# Altium schematic sheet Audio_Moduloop.SchDoc: Audio_Moduloop
size A; Date: 2/27/2024; DrawnBy: Team 28: Ryan Gordon, Conor Curtin, Evan Roveili, Shawn Colby; DocumentNumber: 1; Revision: V1; SheetNumber: 1; SheetTotal: 7
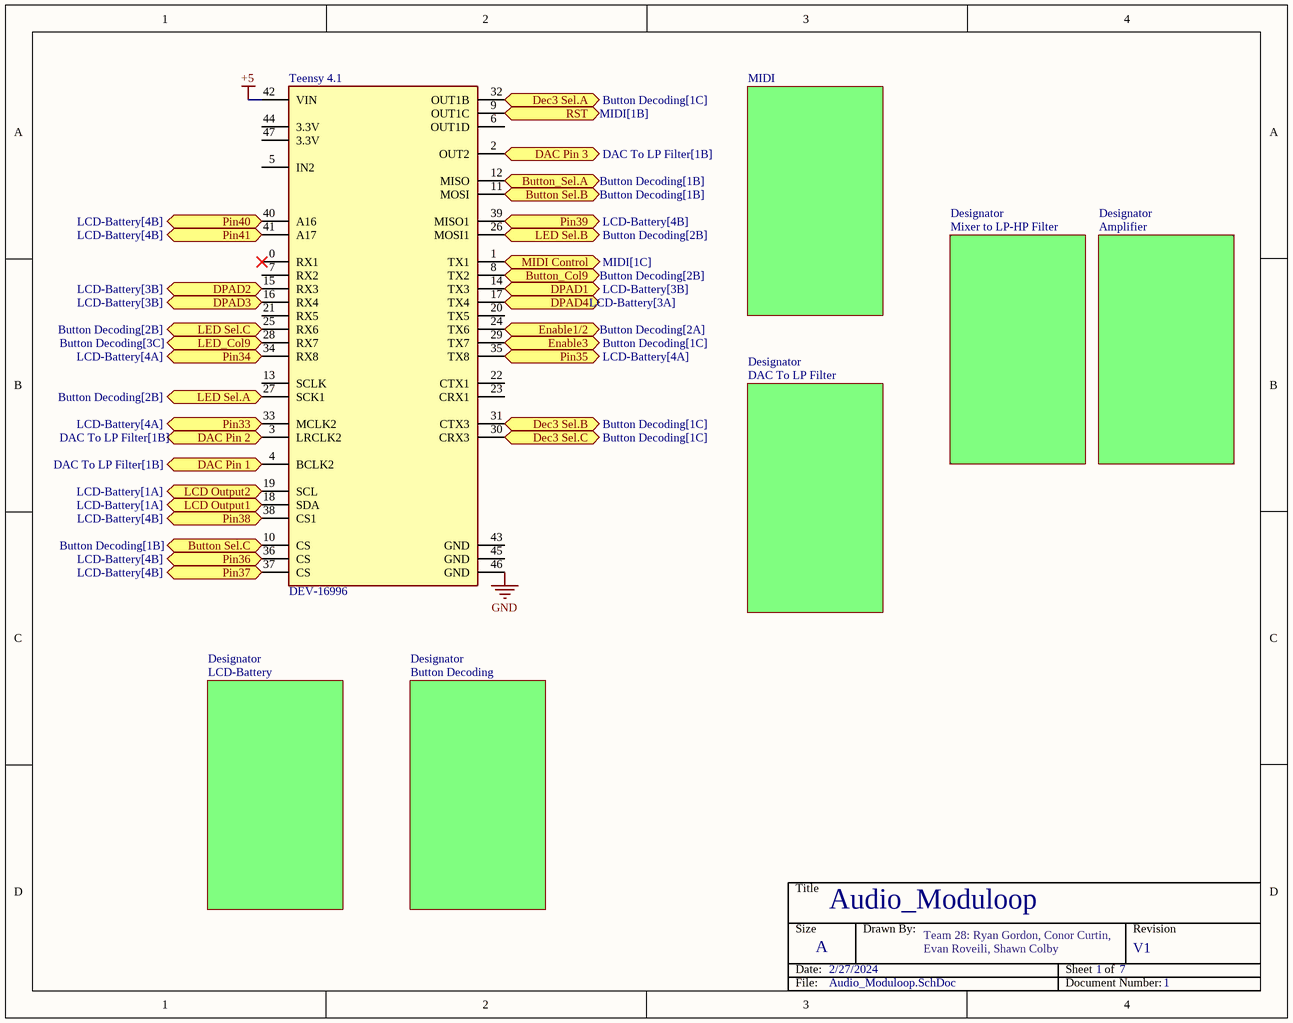
[diagram p0: Audio_Moduloop.SchDoc]

## Parts
Teensy_4.1  DEV-16996  [FP-DEV-16996-MFG]

## Sub-sheets
Designator = Amplifier: no entries
Designator = DAC To LP Filter: no entries
Designator = Button Decoding: no entries
Designator = LCD-Battery: no entries
Designator = Mixer to LP-HP Filter: no entries
MIDI = MIDI: no entries

## Ports
Button Sel.B (bidir, see Button Decoding[1B]), Button Sel.C (bidir, see Button Decoding[1B]), Button_Col9 (bidir, see Button Decoding[2B]), Button_Sel.A (bidir, see Button Decoding[1B]), DAC Pin 1 (bidir, see DAC To LP Filter[1B]), DAC Pin 2 (bidir, see DAC To LP Filter[1B]), DAC Pin 3 (bidir, see DAC To LP Filter[1B]), Dec3 Sel.A (bidir, see Button Decoding[1C]), Dec3 Sel.B (bidir, see Button Decoding[1C]), Dec3 Sel.C (bidir, see Button Decoding[1C]), DPAD1 (bidir, see LCD-Battery[3B]), DPAD2 (bidir, see LCD-Battery[3B]), DPAD3 (bidir, see LCD-Battery[3B]), DPAD4 (bidir, see LCD-Battery[3A]), Enable1/2 (bidir, see Button Decoding[2A]), Enable3 (bidir, see Button Decoding[1C]), LCD Output1 (bidir, see LCD-Battery[1A]), LCD Output2 (bidir, see LCD-Battery[1A]), LED Sel.A (bidir, see Button Decoding[2B]), LED Sel.B (bidir, see Button Decoding[2B]), LED Sel.C (bidir, see Button Decoding[2B]), LED_Col9 (bidir, see Button Decoding[3C]), MIDI Control (bidir, see MIDI[1C]), Pin33 (bidir, see LCD-Battery[4A]), Pin34 (bidir, see LCD-Battery[4A]), Pin35 (bidir, see LCD-Battery[4A]), Pin36 (bidir, see LCD-Battery[4B]), Pin37 (bidir, see LCD-Battery[4B]), Pin38 (bidir, see LCD-Battery[4B]), Pin39 (bidir, see LCD-Battery[4B]), Pin40 (bidir, see LCD-Battery[4B]), Pin41 (bidir, see LCD-Battery[4B]), RST (bidir, see MIDI[1B])

## Nets
+5: Teensy_4.1.42(VIN)
GND: Teensy_4.1.46(GND)
Button Sel.B: Teensy_4.1.11(MOSI) ; port Button Sel.B
Button Sel.C: Teensy_4.1.10(CS) ; port Button Sel.C
Button_Col9: Teensy_4.1.8(TX2) ; port Button_Col9
Button_Sel.A: Teensy_4.1.12(MISO) ; port Button_Sel.A
DAC Pin 1: Teensy_4.1.4(BCLK2) ; port DAC Pin 1
DAC Pin 2: Teensy_4.1.3(LRCLK2) ; port DAC Pin 2
DAC Pin 3: Teensy_4.1.2(OUT2) ; port DAC Pin 3
Dec3 Sel.A: Teensy_4.1.32(OUT1B) ; port Dec3 Sel.A
Dec3 Sel.B: Teensy_4.1.31(CTX3) ; port Dec3 Sel.B
Dec3 Sel.C: Teensy_4.1.30(CRX3) ; port Dec3 Sel.C
DPAD1: Teensy_4.1.14(TX3) ; port DPAD1
DPAD2: Teensy_4.1.15(RX3) ; port DPAD2
DPAD3: Teensy_4.1.16(RX4) ; port DPAD3
DPAD4: Teensy_4.1.17(TX4) ; port DPAD4
Enable1/2: Teensy_4.1.24(TX6) ; port Enable1/2
Enable3: Teensy_4.1.29(TX7) ; port Enable3
LCD Output1: Teensy_4.1.18(SDA) ; port LCD Output1
LCD Output2: Teensy_4.1.19(SCL) ; port LCD Output2
LED Sel.A: Teensy_4.1.27(SCK1) ; port LED Sel.A
LED Sel.B: Teensy_4.1.26(MOSI1) ; port LED Sel.B
LED Sel.C: Teensy_4.1.25(RX6) ; port LED Sel.C
LED_Col9: Teensy_4.1.28(RX7) ; port LED_Col9
MIDI Control: Teensy_4.1.1(TX1) ; port MIDI Control
Pin33: Teensy_4.1.33(MCLK2) ; port Pin33
Pin34: Teensy_4.1.34(RX8) ; port Pin34
Pin35: Teensy_4.1.35(TX8) ; port Pin35
Pin36: Teensy_4.1.36(CS) ; port Pin36
Pin37: Teensy_4.1.37(CS) ; port Pin37
Pin38: Teensy_4.1.38(CS1) ; port Pin38
Pin39: Teensy_4.1.39(MISO1) ; port Pin39
Pin40: Teensy_4.1.40(A16) ; port Pin40
Pin41: Teensy_4.1.41(A17) ; port Pin41
RST: Teensy_4.1.9(OUT1C) ; port RST

Not connected (* = marked no-connect by the designer): Teensy_4.1 0(RX1)* 5(IN2) 6(OUT1D) 7(RX2) 13(SCLK) 20(TX5) 21(RX5) 22(CTX1) 23(CRX1) 43(GND) 44(3.3V) 45(GND) 47(3.3V)

## Notes on the sheet
- Title
- Size
- Date:
- A
- Drawn By:
- Sheet    of
- Revision
- File:
- Document Number:

## Library data of the parts
Teensy_4.1 = CMP-157412-000001-1: TEENSY 4.1 (HEADERS)